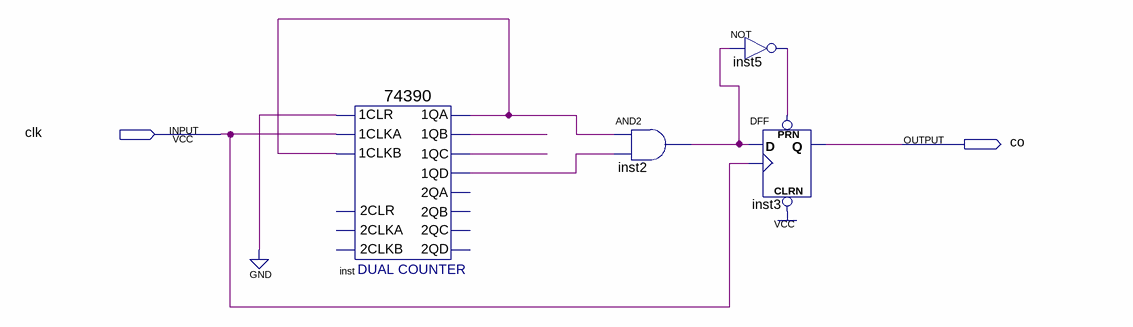
[diagram p0: schematic sheet]
// Quartus schematic cnt10.bdf as structural Verilog: 4 symbols, 2 pins
module cnt10 (
  input  clk,
  output co
);

  wire inst2_out, inst5_out, inst_1qa, inst_1qb, inst_1qc, inst_1qd;

  \74390  inst (
    .\1CLR (1'b0), .\1CLKA (clk), .\1CLKB (inst_1qa), .\1QA (inst_1qa), .\1QB (inst_1qb), .\1QC (inst_1qc),
    .\1QD (inst_1qd));  // open: 2CLKA, 2CLR, 2CLKB, 2QA, 2QB, 2QC, 2QD
  and inst2 (inst2_out, inst_1qa, inst_1qd);
  not inst5 (inst5_out, inst2_out);
  DFF inst3 (.CLRN(1'b1), .CLK(clk), .D(inst2_out), .PRN(inst5_out), .Q(co));
endmodule
